# EAGLE schematic Alternative2 (EAGLE 7.7.0)
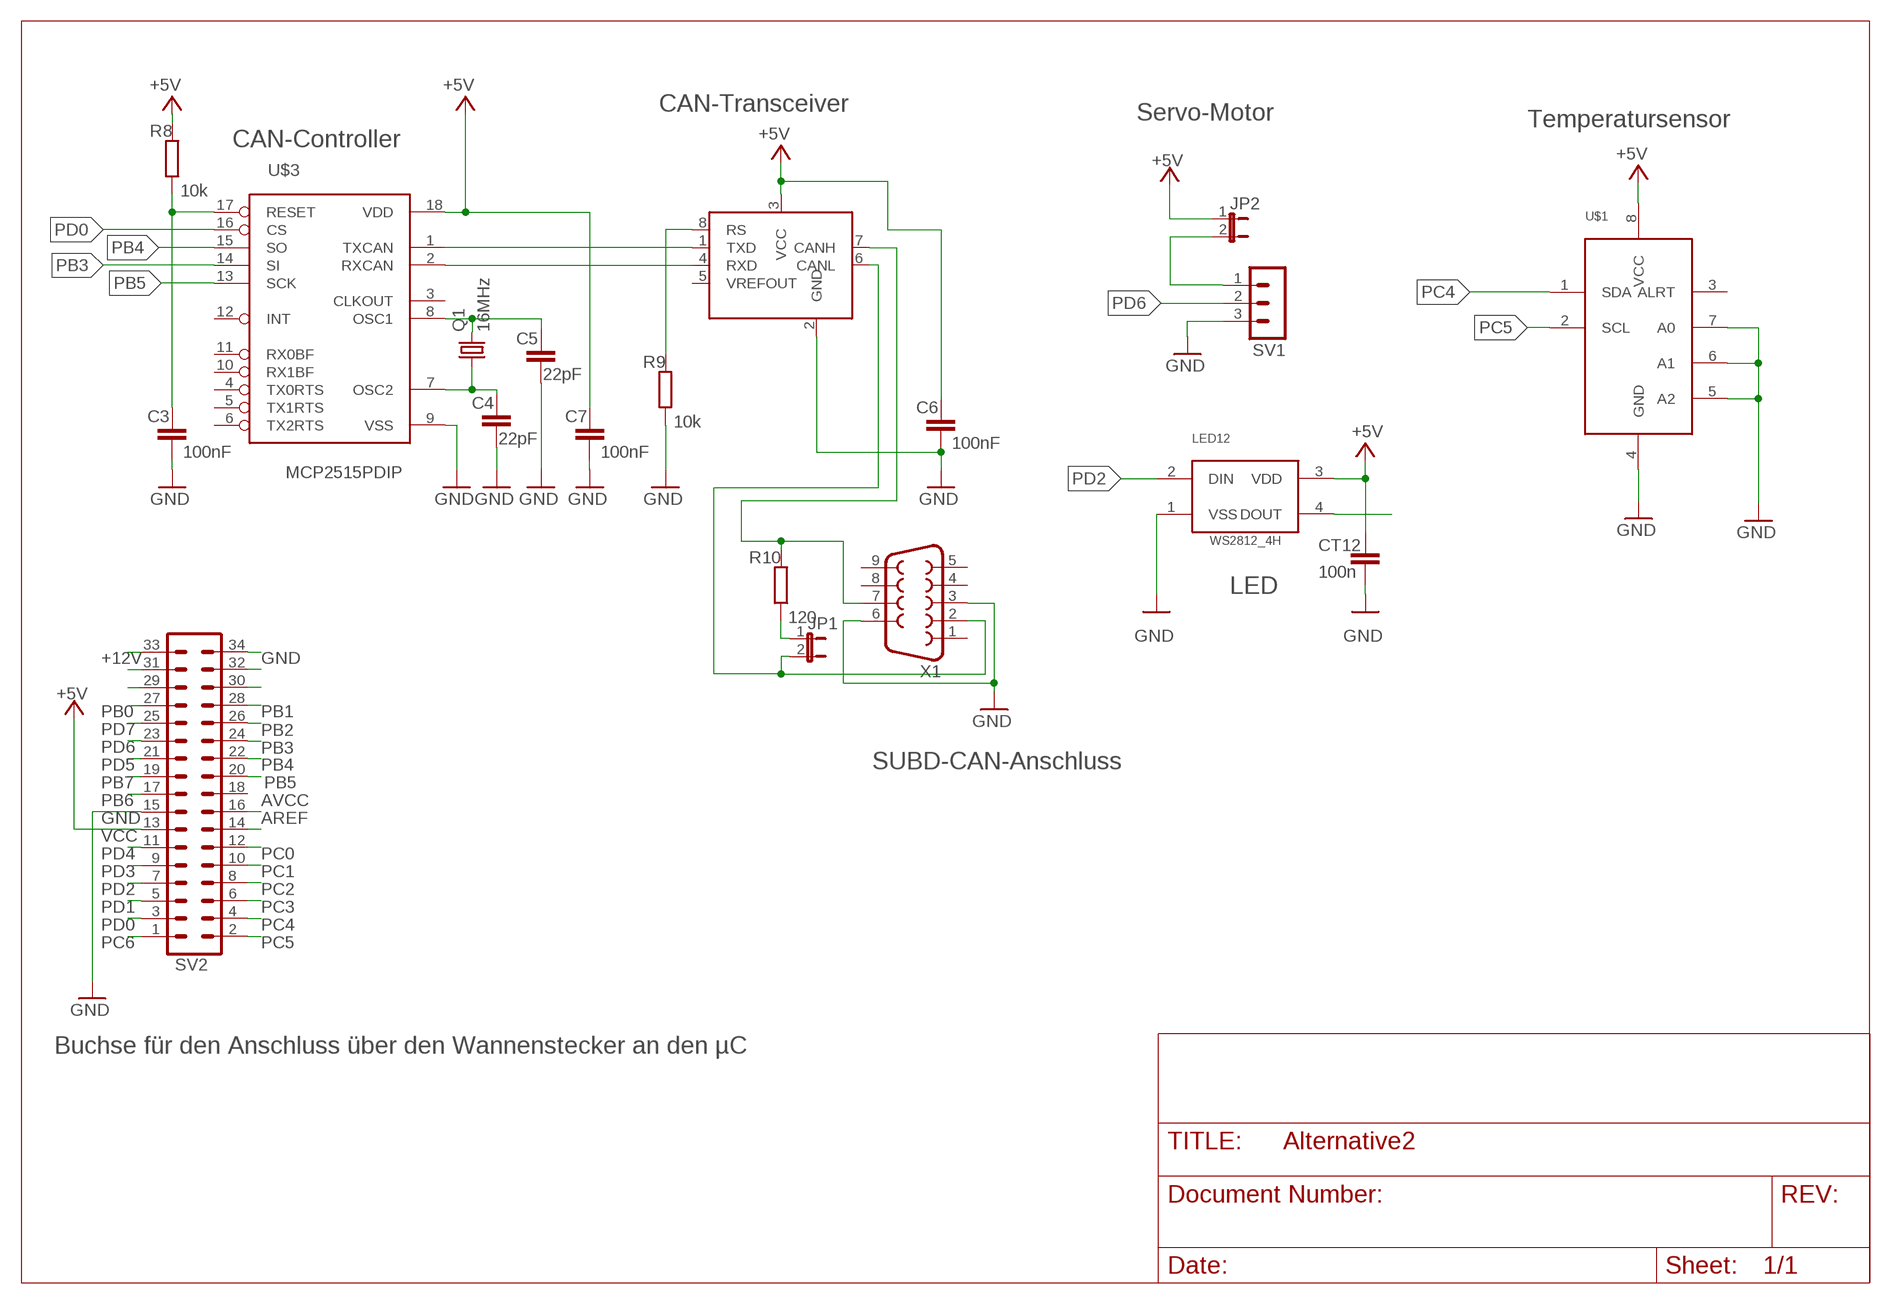
[diagram p0: schematic, sheet 1]

## Parts
C3  100nF  C-EUC0805K  [C0805K]
C4  22pF  C-EUC0805K  [C0805K]
C5  22pF  C-EUC0805K  [C0805K]
C6  100nF  C-EUC0805K  [C0805K]
C7  100nF  C-EUC0805K  [C0805K]
CT12  100n  C-EUC0805  [C0805]
IC2  PCA82C251  82C250SMDSMD  [SO8]
JP1  JP1E  [JP1]
JP2  JP1E  [JP1]
LED12  WS2812_4H  [WS2812_4]
Q1  16MHz  CRYSTALHC49S  [HC49/S]
R8  10k  R-EU_R0805  [R0805]
R9  10k  R-EU_R0805  [R0805]
R10  120  R-EU_R0805  [R0805]
SV1  MA03-1  [MA03-1]
SV2  ML34  [ML34]
U$1  TMP75-SO8  [SO08]
U$3  MCP2515PDIP  [DIL18]
X1  F09HP  [F09HP]

## Nets
+5V: C6.1 C7.1 CT12.1 IC2.3(VCC) JP2.1 LED12.3(VDD) R8.2 SV2.13 U$1.8(VCC) U$3.18(VDD)
+12V: SV2.33
AREF: SV2.16
GND: C3.2 C4.2 C5.2 C6.2 C7.2 CT12.2 IC2.2(GND) LED12.1(VSS) R9.1 SV1.3 SV2.15 SV2.34 U$1.4(GND) U$1.5(A2) U$1.6(A1) U$1.7(A0) U$3.9(VSS) X1.3 X1.6
N$1: SV2.14
N$2: C5.1 Q1.2 U$3.8(OSC1)
N$3: C4.1 Q1.1 U$3.7(OSC2)
N$4: C3.1 R8.1 U$3.17(RESET)
N$5: IC2.8(RS) R9.2
N$6: IC2.4(RXD) U$3.2(RXCAN)
N$7: IC2.1(TXD) U$3.1(TXCAN)
N$8: IC2.7(CANH) R10.2 X1.7
N$9: JP1.1 R10.1
N$10: IC2.6(CANL) JP1.2 X1.2
N$12: LED12.4(DOUT)
N$16: JP2.2 SV1.1
N$40: SV2.29
N$41: SV2.31
N$44: SV2.32
N$45: SV2.30
PB0: SV2.27
PB1: SV2.28
PB2: SV2.26
PB3: SV2.24 U$3.14(SI)
PB4: SV2.22 U$3.15(SO)
PB5: SV2.20 U$3.13(SCK)
PB6: SV2.17
PB7: SV2.19
PC0: SV2.12
PC1: SV2.10
PC2: SV2.8
PC3: SV2.6
PC4: SV2.4 U$1.1(SDA)
PC5: SV2.2 U$1.2(SCL)
PC6: SV2.1
PD0: SV2.3 U$3.16(CS)
PD1: SV2.5
PD2: LED12.2(DIN) SV2.7
PD3: SV2.9
PD4: SV2.11
PD5: SV2.21
PD6: SV1.2 SV2.23
PD7: SV2.25
Unconnected: IC2.5(VREFOUT) SV2.18 U$1.3(ALRT) U$3.3(CLKOUT) U$3.4(TX0RTS) U$3.5(TX1RTS) U$3.6(TX2RTS) U$3.10(RX1BF) U$3.11(RX0BF) U$3.12(INT) X1.1 X1.4 X1.5 X1.8 X1.9

## Notes on the sheet
- CAN-Transceiver
- Servo-Motor | Temperatursensor
- CAN-Controller
- LED
- SUBD-CAN-Anschluss
- AVCC
- VCC
- Buchse für den Anschluss über den Wannenstecker an den µC

## Library data of the parts
C3-C7 CT12 = rcl:C-EU: CAPACITOR, European symbol
IC2 = philips:82C250SMD
JP1 JP2 = jumper:JP1E: JUMPER
LED12 = sp2:WS2812_4
Q1 = crystal:CRYSTAL: CRYSTAL; OC_FARNELL: 1667008; OC_NEWARK: unknown
R8-R10 = rcl:R-EU_: RESISTOR, European symbol
SV1 = con-lstb:MA03-1: PIN HEADER; OC_FARNELL: unknown; OC_NEWARK: unknown
SV2 = con-harting-ml:ML34: HARTING; OC_FARNELL: unknown; OC_NEWARK: unknown
U$1 = sp2:TMP75
U$3 = sp2:MCP2515
X1 = con-subd:F09: SUB-D; OC_FARNELL: unknown; OC_NEWARK: unknown